# Altium schematic sheet Herradura.SchDoc
size A4; Organization: Altium Limited; Address1: L3, 12a Rodborough Rd; Address2: Frenchs Forest; Address3: NSW; Address4: Australia 2086; SheetNumber: 2; SheetTotal: 10
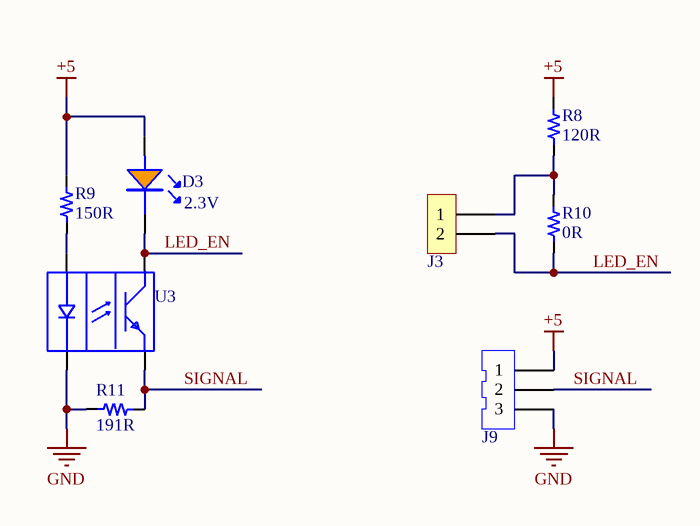
[diagram p0: Herradura.SchDoc]

## Parts
D3  2.3V  [0805_LED]
J3  2x1  [H_2x1_TH_100mil]  (value not drawn)  (no BOM)
J9  CONN HEADER TH 3POS 2.5mm  (value not drawn)
R8  value 120R  [0603_res]  (hidden comment: 120R 1/10W)
R9  value 150R  [0603_res]  (hidden comment: 150R 1/10W)
R10  value 0R  [0603_res]  (hidden comment: 0R 1/10W)
R11  value 191R  [0603_res]  (hidden comment: 191R 1/10W)
U3  SENSOR OPT SLOT PHOTOTRAN PCB MT  [RES_0402]  (value not drawn)

## Nets
+5: D3.1(A) J9.1 R8.2 R9.2
GND: J9.3 R11.1 U3.1(CATHODE)
LED_EN: D3.2 J3.2 R10.1 U3.3(COLLECTOR)
SIGNAL: J9.2 R11.2 U3.4(EMISOR)
NetJ3_1: J3.1 R8.1 R10.2
NetR9_1: R9.1 U3.2(ANODE)

## Notes on the sheet
- Title
- Size:
- Date:
- A4
- Number:
- Time:
- Revision:
- Sheet
- of
- File:

## Library data of the parts
D3 = LED_0805_Orange: LED ORANGE WATER CLEAR 0805 SMD; Manufacturer: XINGLIGHT; Manufacturer Part Number: XL-2012UOC; Supplier 1: LCSC; Supplier Part Number 1: C965813; ComponentLink1Description: LCSC; ComponentLink1URL: https://www.lcsc.com/product-detail/C965813.html?s_z=n_XINGLIGHT%2520XL-2012
J3 = H_Male_2x1_TH_100mil: ComponentLink1Description: LCSC
J9 = Connector JST 3pin: 3P 1x3P XH Tin -25℃~+85℃ White 2.5mm 250V 3 3A 1 Through Hole Through Hole,P=2.5mm Headers, Male Pins RoHS; Manufacturer: JST; Manufacturer Part Number: B3B-XH-A(LF)(SN); Supplier 1: LCSC; Supplier Part Number 1: C144394; ComponentLink1Description: LCSC; ComponentLink1URL: https://www.lcsc.com/product-detail/C144394.html?s_z=n_JST%2520b3
R8 = Res_120R_0603_1/10W: 100mW Thick Film Resistor 75V ±100ppm/℃ ±1% 120Ω 0603 Chip Resistor - Surface Mount ROHS; Manufacturer: FOJAN; Manufacturer Part Number: FRC0603F1200TS; ComponentLink1URL: https://lcsc.com/product-detail/Chip-Resistor-Surface-Mount_FOJAN-FRC0603F1200TS_C2906988.html; Supplier 1: LCSC; Supplier Part Number 1: C2906988; ComponentLink1Description: LCSC
R9 = Res_150R_0603_1/10W: 100mW Thick Film Resistor 75V ±100ppm/℃ ±1% 150Ω 0603 Chip Resistor - Surface Mount ROHS; Manufacturer: RALEC; Manufacturer Part Number: RTT031500FTP; ComponentLink1URL: https://lcsc.com/product-detail/Chip-Resistor-Surface-Mount_RALEC-RTT031500FTP_C103302.html; Supplier 1: LCSC; Supplier Part Number 1: C103302; ComponentLink1Description: LCSC
R10 = Res_0R_0603_1/10W: RES SMD 0R OHM 5% 1/10W 0603; Manufacturer: FOJAN; Manufacturer Part Number: FRC0603P000 TS; ComponentLink1URL: https://www.lcsc.com/product-detail/Chip-Resistor-Surface-Mount_FOJAN-FRC0603P000-TS_C2907080.html; Supplier 1: LCSC; Supplier Part Number 1: C2907080; ComponentLink1Description: LCSC
R11 = Res_191R_0603_1/10W: 100mW Thick Film Resistor 75V ±100ppm/℃ ±1% 191Ω 0603 Chip Resistor - Surface Mount ROHS; Manufacturer: FOJAN; Manufacturer Part Number: FRC0603F1910TS; ComponentLink1URL: https://lcsc.com/product-detail/Chip-Resistor-Surface-Mount_FOJAN-FRC0603F1910TS_C3000718.html; Supplier 1: LCSC; Supplier Part Number 1: C3000718; ComponentLink1Description: LCSC
U3 = RPI-441C1E: 850nm 1.4V DIP-4 Photointerrupters - Slot Type - Transistor Output RoHS; Manufacturer: ROHM; Supplier 1: LCSC; Supplier Part Number 1: C919442; Manufacturer Part Number: RPI-441C1E; ComponentLink1Description: LCSC; ComponentLink1URL: https://www.lcsc.com/product-detail/C919442.html?s_z=n_RPI-441C1